# Altium schematic sheet Output curcuits. Page 3.SchDoc
size 420 x 297 mm; Address1: Address1; Address2: Address2; Address3: Address3; Address4: Address4; DocumentNumber: АБВГ.123456.001 Э3; SheetNumber: 3; SheetTotal: 4; Scale: 1:1; DocumentType: Схема электрическая принципиальная; FirstReferrence: АБВГ.123456.001
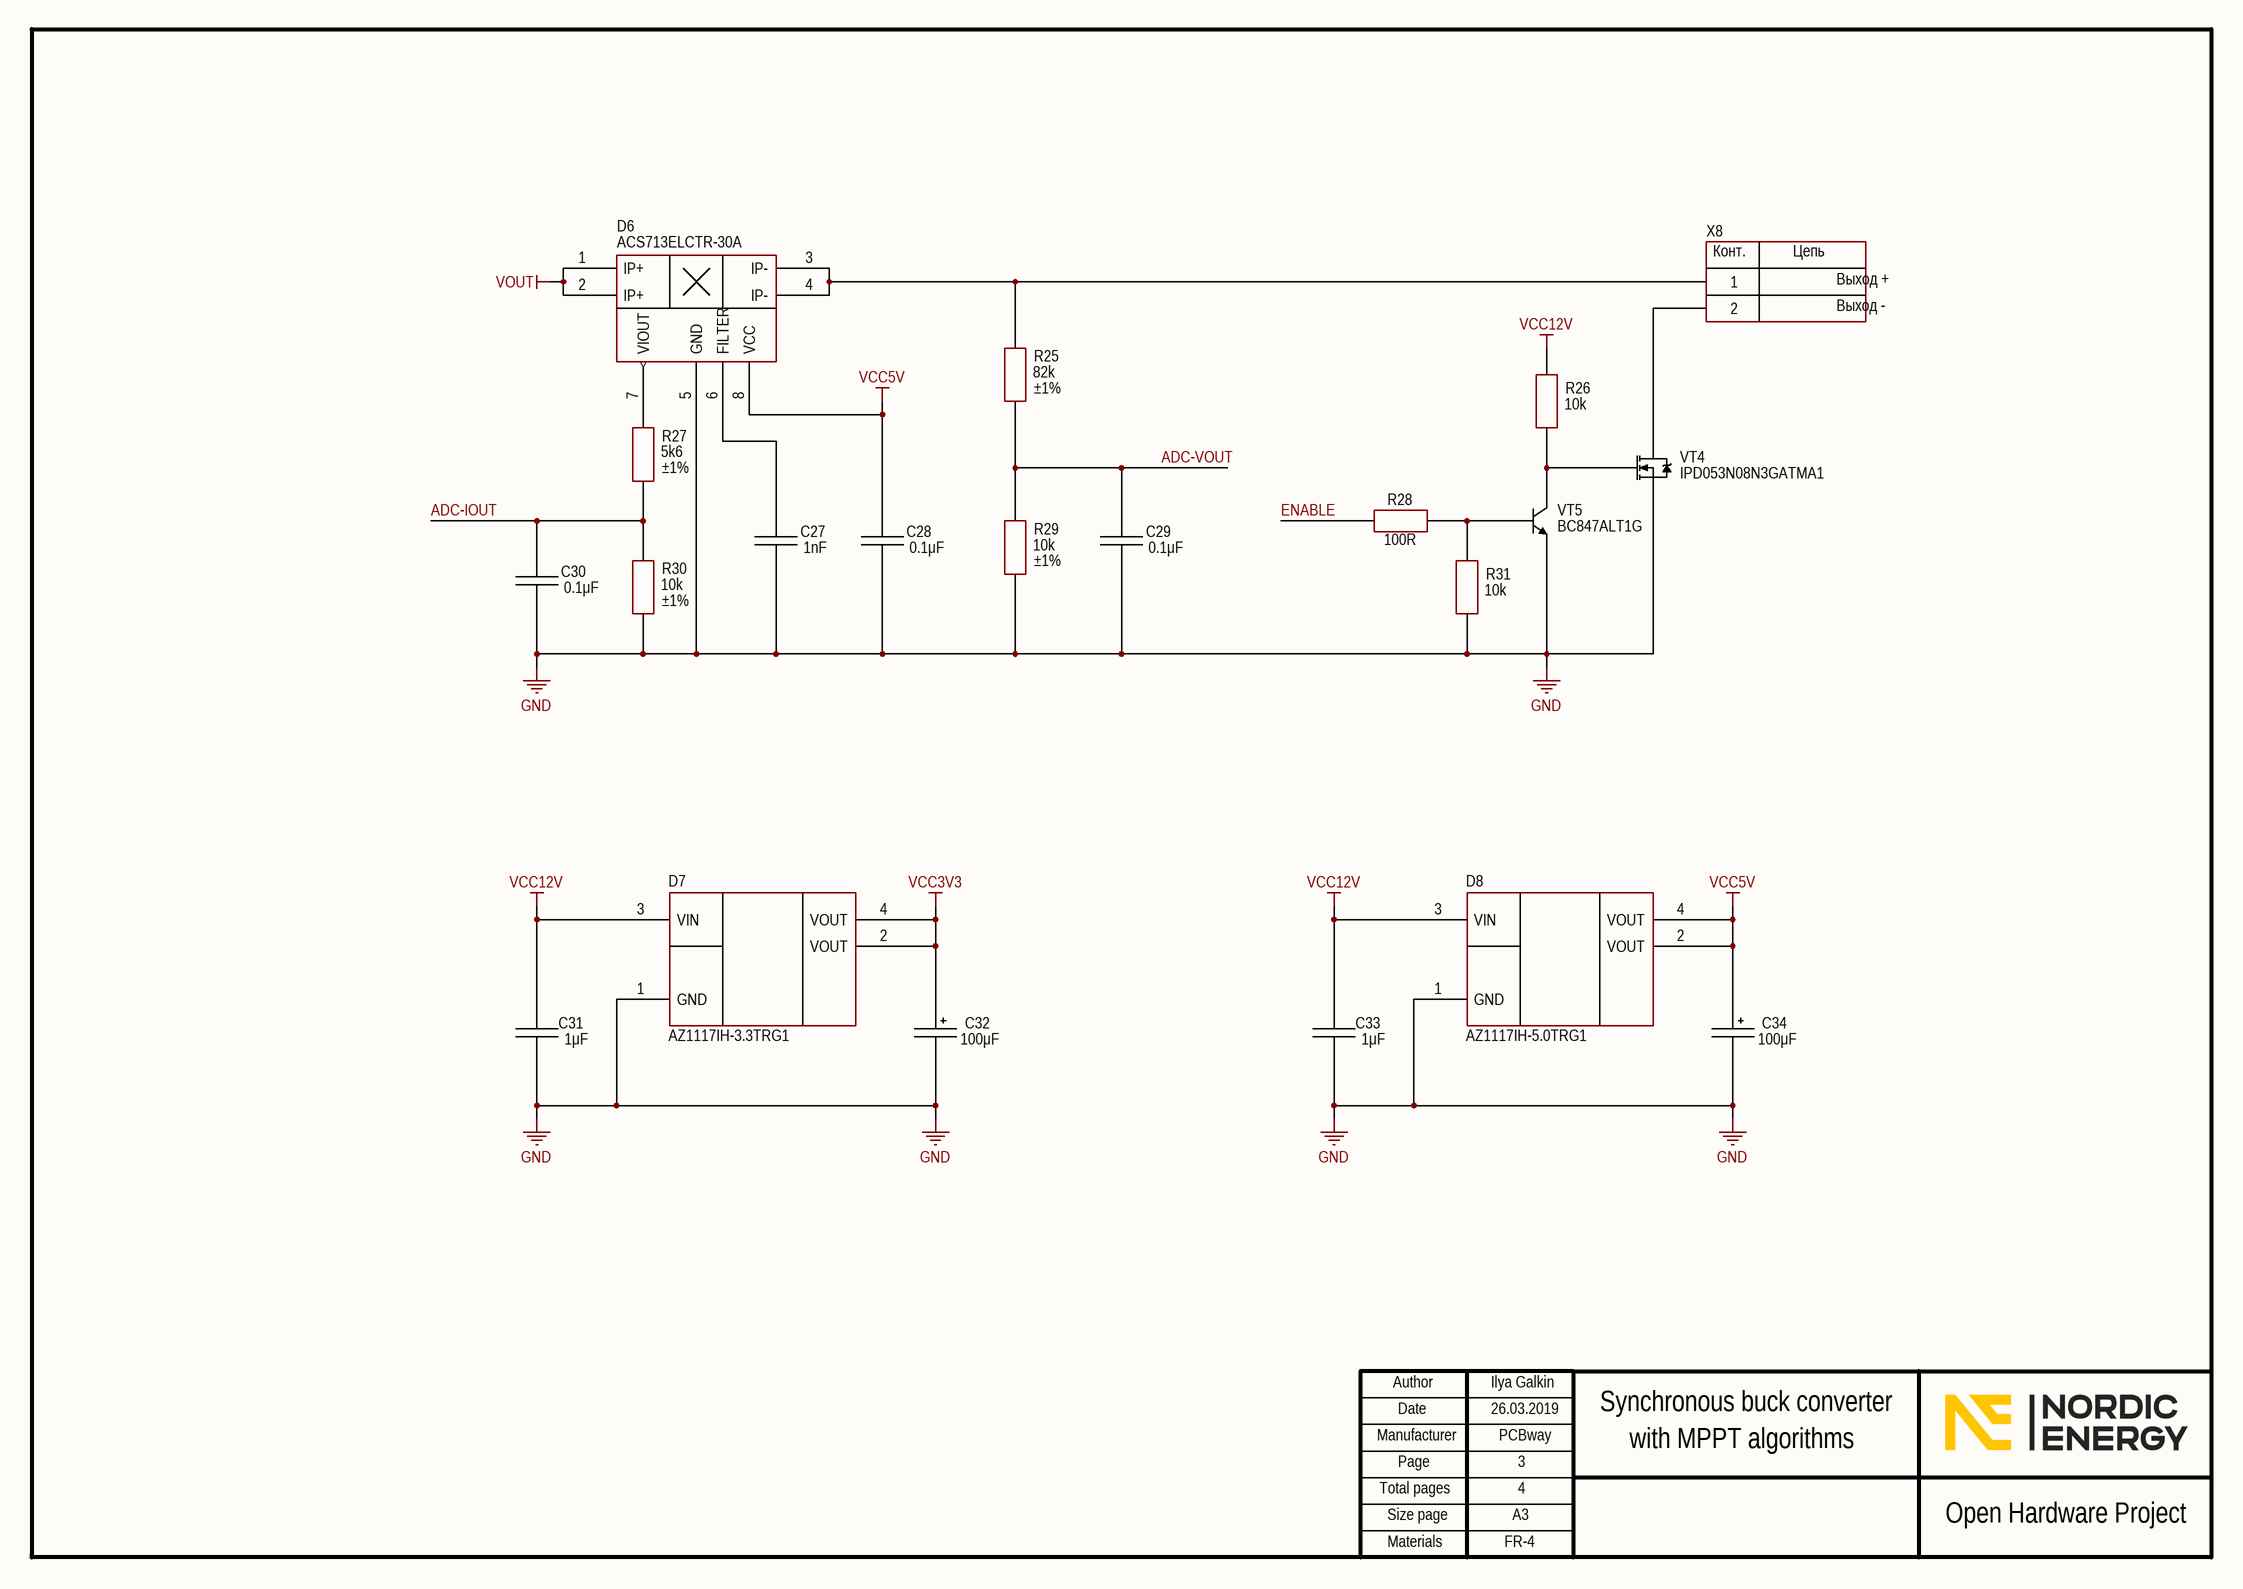
[diagram p0: Output curcuits. Page 3.SchDoc]

## Parts
C27  1nF  [CH0805C]
C28  0.1μF  [CH0805C]
C29  0.1μF  [CH0805C]
C30  0.1μF  [CH0805C]
C31  1μF  [CH0805C]
C32  100μF  [TANTAL_A]
C33  1μF  [CH0805C]
C34  100μF  [TANTAL_A]
D6  ACS713ELCTR-30A  [8-SOIC]
D7  AZ1117IH-3.3TRG1  [SOT223]
D8  AZ1117IH-5.0TRG1  [SOT223]
R25  82k  ComponentKind: ±1%  [CH0805R]
R26  10k  [CH0805R]
R27  5k6  ComponentKind: ±1%  [CH0805R]
R28  100R  [CH0805R]
R29  10k  ComponentKind: ±1%  [CH0805R]
R30  10k  ComponentKind: ±1%  [CH0805R]
R31  10k  [CH0805R]
VT4  IPD053N08N3GATMA1  [D2PAK]
VT5  BC847ALT1G  [SOT23_123]
X8  6PCV-02-006  [CON: 6PCV-02-006]  (value not drawn)

## Nets
GND: C27.1 C28.1 C29.1 C30.1 C31.1 C32.2 C33.1 C34.2 D6.5(GND) D7.1(GND) D8.1(GND) R29.1 R30.1 R31.1 VT4.3(S) VT5.3(E)
VCC3V3: C32.1 D7.2(VOUT) D7.4(VOUT)
VCC5V: C28.2 C34.1 D6.8(VCC) D8.2(VOUT) D8.4(VOUT)
VCC12V: C31.2 C33.2 D7.3(VIN) D8.3(VIN) R26.2
VOUT: D6.1(IP+) D6.2(IP+)
ADC-IOUT: C30.2 R27.1 R30.2
ADC-VOUT: C29.2 R25.1 R29.2
ENABLE: R28.1
NetC27_2: C27.2 D6.6(FILTER)
NetD6_3: D6.3(IP-) D6.4(IP-) R25.2 X8.1
NetD6_7: D6.7(VIOUT) R27.2
NetR26_1: R26.1 VT4.1(G) VT5.2(C)
NetR28_2: R28.2 R31.2 VT5.1(B)
NetVT4_2: VT4.2(D) X8.2

## Notes on the sheet
- Выход +
- Выход -
- Ilya Galkin
- 26.03.2019
- PCBway
- 3
- Synchronous buck converter
- with MPPT algorithms
- 4
- FR-4
- Author
- Manufacturer
- Date
- Page
- Total pages
- Size page
- A3
- Open Hardware Project
- Materials
- (in symbol 2-Connector) Конт.; Цепь

## Library data of the parts
C27 = Capacitor: Manufacturer: Yageo; Model: CC0805KRX7R9BB102; HelpURL: https://www.digikey.com/product-detail/en/yageo/CC0805KRX7R9BB102/311-1127-1-ND/303037; ComponentKind: X7R; Value: 1nF
C28-C30 = Capacitor: Manufacturer: Yageo; Model: CC0805KRX7R8BB104; HelpURL: https://www.digikey.com/product-detail/en/yageo/CC0805KRX7R8BB104/311-1141-1-ND/303051; ComponentKind: X7R; Value: 0.1μF
C31 C33 = Capacitor: Manufacturer: Yageo; Model: CC0805JKX7R7BB105; HelpURL: https://www.digikey.com/product-detail/en/yageo/CC0805JKX7R7BB105/311-3497-1-ND/7164518; ComponentKind: X7R; Value: 1μF
C32 C34 = TantalCap: Manufacturer: AVX; Model: TLJA107M006R0800; HelpURL: https://www.digikey.com/product-detail/en/avx-corporation/TLJA107M006R0800/478-11096-1-ND/7536303; ComponentKind: 6.3V; Value: 100μF
D6 = ACS713ELCTR-30A-T: Sensor; Manufacturer: Allegro MicroSystems, LLC; Model: ACS713ELCTR-30A-T; HelpURL: https://www.digikey.com/product-detail/en/allegro-microsystems-llc/ACS713ELCTR-30A-T/620-1193-1-ND/1284610; ComponentKind: 8-SOIC
D7 D8 = LDL1117S33R: LDO; Manufacturer: Diodes Incorporated; ComponentKind: SOT-223
  D7: Model: AZ1117IH-3.3TRG1; HelpURL: https://www.digikey.com/product-detail/en/diodes-incorporated/AZ1117IH-3.3TRG1/AZ1117IH-3.3TRG1DIDKR-ND/5699692
  D8: Model: AZ1117IH-5.0TRG1; HelpURL: https://www.digikey.com/product-detail/en/diodes-incorporated/AZ1117IH-5.0TRG1/AZ1117IH-5.0TRG1DICT-ND/5699683
R25 = Resistor: Manufacturer: Yageo; Model: RC0805FR-0782KL; HelpURL: https://www.digikey.com/product-detail/en/yageo/RC0805FR-0782KL/311-82.0KCRDKR-ND/734059; Value: 82k
R26 R31 = Resistor: Manufacturer: Yageo; Model: RC0805JR-0710KL; HelpURL: https://www.digikey.com/product-detail/en/yageo/RC0805JR-0710KL/311-10KARCT-ND/731188; ComponentKind: ±5%; Value: 10k
R27 = Resistor: Manufacturer: Yageo; Model: RC0805FR-075K6L; HelpURL: https://www.digikey.com/product-detail/en/yageo/RC0805FR-075K6L/311-5.60KCRCT-ND/730949; Value: 5k6
R28 = Resistor: Manufacturer: Yageo; Model: RC0805JR-07100RL; HelpURL: https://www.digikey.com/product-detail/en/yageo/RC0805JR-07100RL/311-100ARCT-ND/731185; ComponentKind: ±5%; Value: 100R
R29 R30 = Resistor: Manufacturer: Yageo; Model: RC0805FR-0710KL; HelpURL: https://www.digikey.com/product-detail/en/yageo/RC0805FR-0710KL/311-10.0KCRCT-ND/730482; Value: 10k
VT4 = N-chanel: Mosfet; Manufacturer: Infineon; Model: IPD053N08N3GATMA1; ComponentKind: 80V; HelpURL: https://www.digikey.com/product-detail/en/infineon-technologies/IPD053N08N3GATMA1/IPD053N08N3GATMA1CT-ND/5353500
VT5 = NPN: Bipolar; Manufacturer: ON Semiconductor; Model: BC847ALT1G; ComponentKind: 45V; HelpURL: https://www.digikey.com/product-detail/en/on-semiconductor/BC847ALT1G/BC847ALT1GOSCT-ND/917833
X8 = 2-Connector: Manufacturer: TE Connectivity; Model: 6PCV-02-006; HelpURL: https://www.digikey.com/products/en?keywords=6pcv-02-006; ComponentKind: 25A